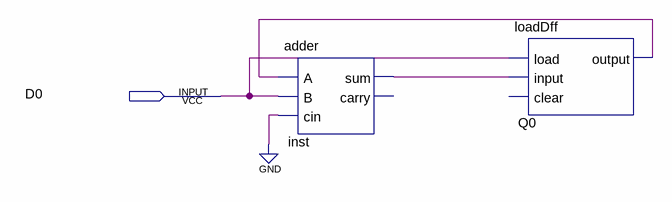
[diagram p0: schematic sheet]
// Quartus schematic lab06.bdf as structural Verilog: 2 symbols, 1 pins
module lab06 (
  input  D0
);

  wire inst_sum, Q0_output;

  adder inst (.A(Q0_output), .B(D0), .cin(1'b0), .sum(inst_sum));  // open: carry
  loadDff Q0 (.load(D0), .\input (inst_sum), .\output (Q0_output));  // open: clear
endmodule
